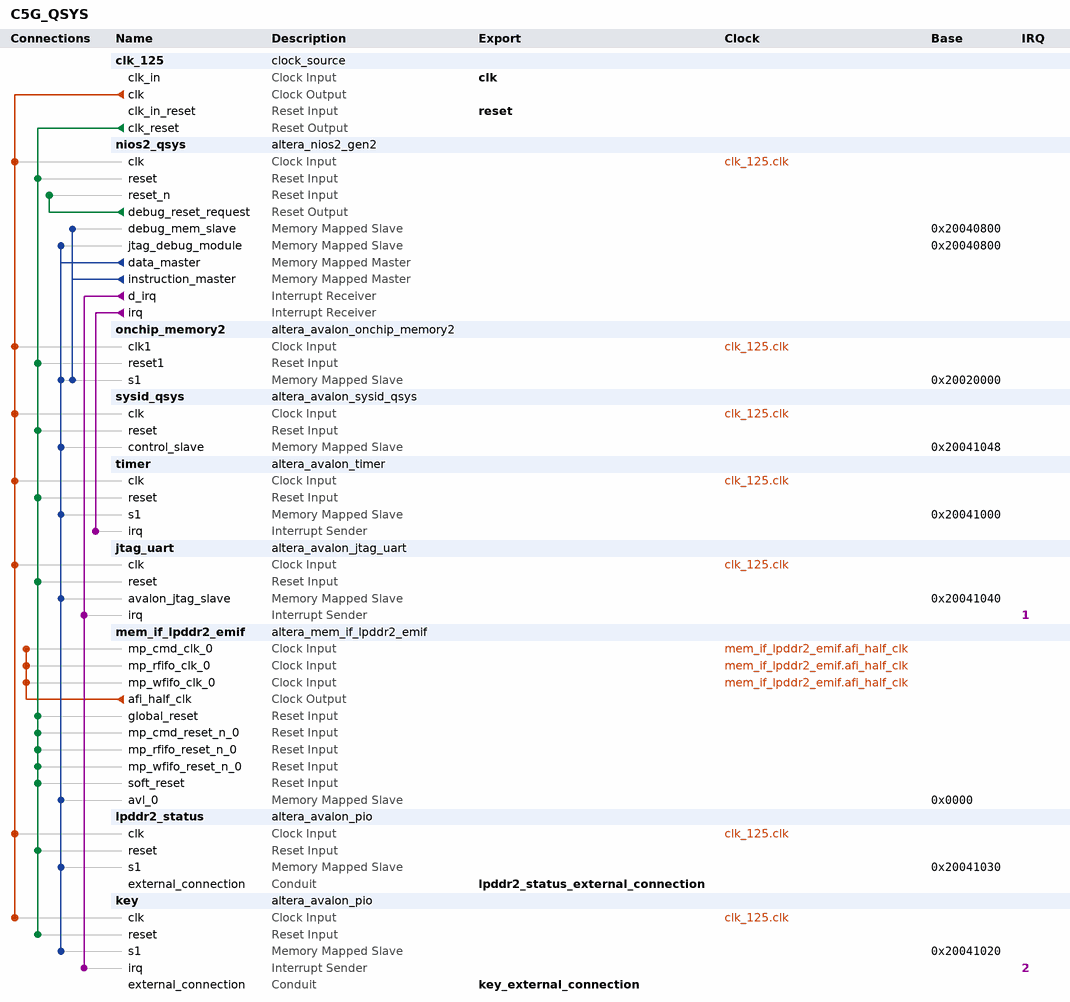
[diagram p0: system contents]
# Platform Designer (Qsys) system C5G_QSYS, Arria 10 10AS016C3U19E2LG
# Parameters at their usual value, and those the tool derives, are not listed.
package require -exact qsys 1.0
create_system C5G_QSYS
set_project_property DEVICE_FAMILY {Arria 10}
set_project_property DEVICE 10AS016C3U19E2LG

add_component clk_125 ip/C5G_QSYS/C5G_QSYS_clk_125.ip clock_source clk_125 

add_component nios2_qsys ip/C5G_QSYS/C5G_QSYS_nios2_qsys.ip altera_nios2_gen2 nios2_qsys 17.1

add_component onchip_memory2 ip/C5G_QSYS/C5G_QSYS_onchip_memory2.ip altera_avalon_onchip_memory2 onchip_memory2 17.1

add_component sysid_qsys ip/C5G_QSYS/C5G_QSYS_sysid_qsys.ip altera_avalon_sysid_qsys sysid_qsys 17.1

add_component timer ip/C5G_QSYS/C5G_QSYS_timer.ip altera_avalon_timer timer 17.1

add_component jtag_uart ip/C5G_QSYS/C5G_QSYS_jtag_uart.ip altera_avalon_jtag_uart jtag_uart 17.1

add_component mem_if_lpddr2_emif ip/C5G_QSYS/C5G_QSYS_mem_if_lpddr2_emif.ip altera_mem_if_lpddr2_emif mem_if_lpddr2_emif 17.1

add_component lpddr2_status ip/C5G_QSYS/C5G_QSYS_lpddr2_status.ip altera_avalon_pio lpddr2_status 17.1

add_component key ip/C5G_QSYS/C5G_QSYS_key.ip altera_avalon_pio key 17.1

# connections
add_connection clk_125.clk jtag_uart.clk clock
add_connection clk_125.clk key.clk clock
add_connection clk_125.clk lpddr2_status.clk clock
add_connection clk_125.clk nios2_qsys.clk clock
add_connection clk_125.clk onchip_memory2.clk1 clock
add_connection clk_125.clk sysid_qsys.clk clock
add_connection clk_125.clk timer.clk clock
add_connection mem_if_lpddr2_emif.afi_half_clk mem_if_lpddr2_emif.mp_cmd_clk_0 clock
add_connection mem_if_lpddr2_emif.afi_half_clk mem_if_lpddr2_emif.mp_rfifo_clk_0 clock
add_connection mem_if_lpddr2_emif.afi_half_clk mem_if_lpddr2_emif.mp_wfifo_clk_0 clock
add_connection clk_125.clk_reset jtag_uart.reset reset
add_connection clk_125.clk_reset key.reset reset
add_connection clk_125.clk_reset lpddr2_status.reset reset
add_connection clk_125.clk_reset mem_if_lpddr2_emif.global_reset reset
add_connection clk_125.clk_reset mem_if_lpddr2_emif.mp_cmd_reset_n_0 reset
add_connection clk_125.clk_reset mem_if_lpddr2_emif.mp_rfifo_reset_n_0 reset
add_connection clk_125.clk_reset mem_if_lpddr2_emif.mp_wfifo_reset_n_0 reset
add_connection clk_125.clk_reset mem_if_lpddr2_emif.soft_reset reset
add_connection clk_125.clk_reset nios2_qsys.reset reset
add_connection clk_125.clk_reset onchip_memory2.reset1 reset
add_connection clk_125.clk_reset sysid_qsys.reset reset
add_connection clk_125.clk_reset timer.reset reset
add_connection nios2_qsys.debug_reset_request nios2_qsys.reset_n reset
add_connection nios2_qsys.data_master jtag_uart.avalon_jtag_slave avalon
set_connection_parameter_value nios2_qsys.data_master/jtag_uart.avalon_jtag_slave baseAddress 0x20041040
add_connection nios2_qsys.data_master key.s1 avalon
set_connection_parameter_value nios2_qsys.data_master/key.s1 baseAddress 0x20041020
add_connection nios2_qsys.data_master lpddr2_status.s1 avalon
set_connection_parameter_value nios2_qsys.data_master/lpddr2_status.s1 baseAddress 0x20041030
add_connection nios2_qsys.data_master mem_if_lpddr2_emif.avl_0 avalon
set_connection_parameter_value nios2_qsys.data_master/mem_if_lpddr2_emif.avl_0 baseAddress 0x0000
add_connection nios2_qsys.data_master nios2_qsys.jtag_debug_module avalon
set_connection_parameter_value nios2_qsys.data_master/nios2_qsys.jtag_debug_module baseAddress 0x20040800
add_connection nios2_qsys.data_master onchip_memory2.s1 avalon
set_connection_parameter_value nios2_qsys.data_master/onchip_memory2.s1 baseAddress 0x20020000
add_connection nios2_qsys.data_master sysid_qsys.control_slave avalon
set_connection_parameter_value nios2_qsys.data_master/sysid_qsys.control_slave baseAddress 0x20041048
add_connection nios2_qsys.data_master timer.s1 avalon
set_connection_parameter_value nios2_qsys.data_master/timer.s1 baseAddress 0x20041000
add_connection nios2_qsys.instruction_master nios2_qsys.debug_mem_slave avalon
set_connection_parameter_value nios2_qsys.instruction_master/nios2_qsys.debug_mem_slave baseAddress 0x20040800
add_connection nios2_qsys.instruction_master onchip_memory2.s1 avalon
set_connection_parameter_value nios2_qsys.instruction_master/onchip_memory2.s1 baseAddress 0x20020000
add_connection nios2_qsys.d_irq jtag_uart.irq interrupt
set_connection_parameter_value nios2_qsys.d_irq/jtag_uart.irq irqNumber 1
add_connection nios2_qsys.d_irq key.irq interrupt
set_connection_parameter_value nios2_qsys.d_irq/key.irq irqNumber 2
add_connection nios2_qsys.irq timer.irq interrupt

# exported interfaces
add_interface clk clock sink
set_interface_property clk EXPORT_OF clk_125.clk_in
add_interface key_external_connection conduit end
set_interface_property key_external_connection EXPORT_OF key.external_connection
add_interface lpddr2_status_external_connection conduit end
set_interface_property lpddr2_status_external_connection EXPORT_OF lpddr2_status.external_connection
add_interface reset reset sink
set_interface_property reset EXPORT_OF clk_125.clk_in_reset

set_interconnect_requirement {$system} qsys_mm.clockCrossingAdapter HANDSHAKE
set_interconnect_requirement {$system} qsys_mm.maxAdditionalLatency 1

save_system C5G_QSYS.qsys
